# Altium schematic sheet 0003_INDEX -2.SchDoc
size 848 x 558 mm
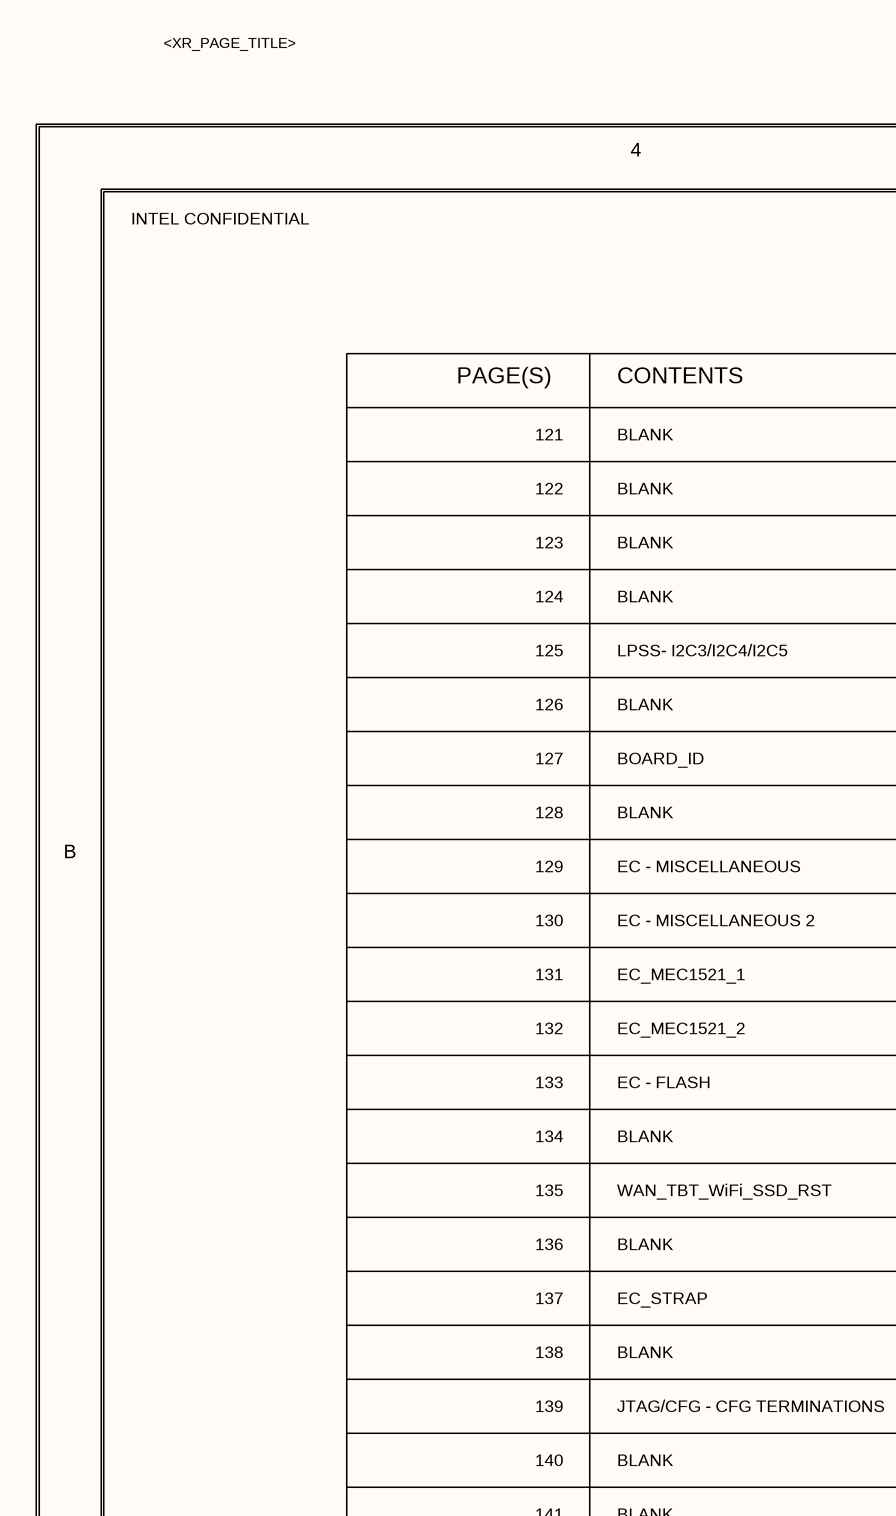
[diagram p0: 0003_INDEX -2.SchDoc, top left]
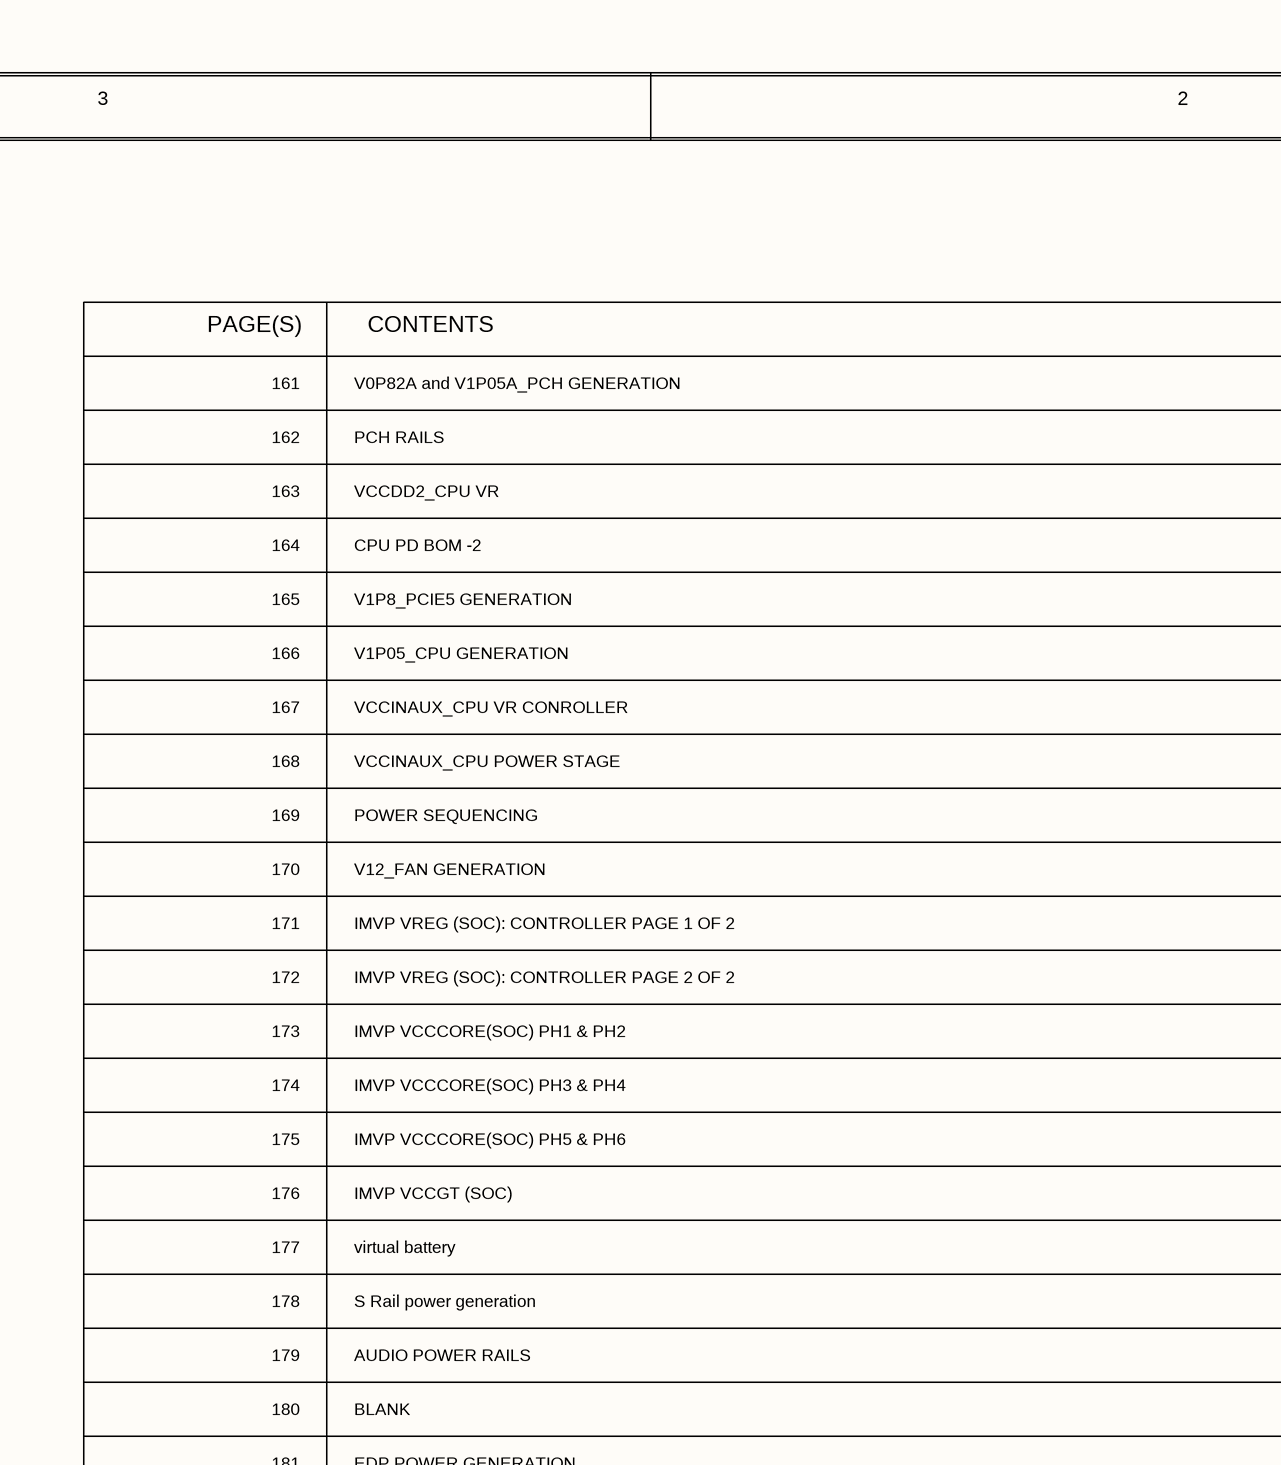
[diagram p1: 0003_INDEX -2.SchDoc, top middle]
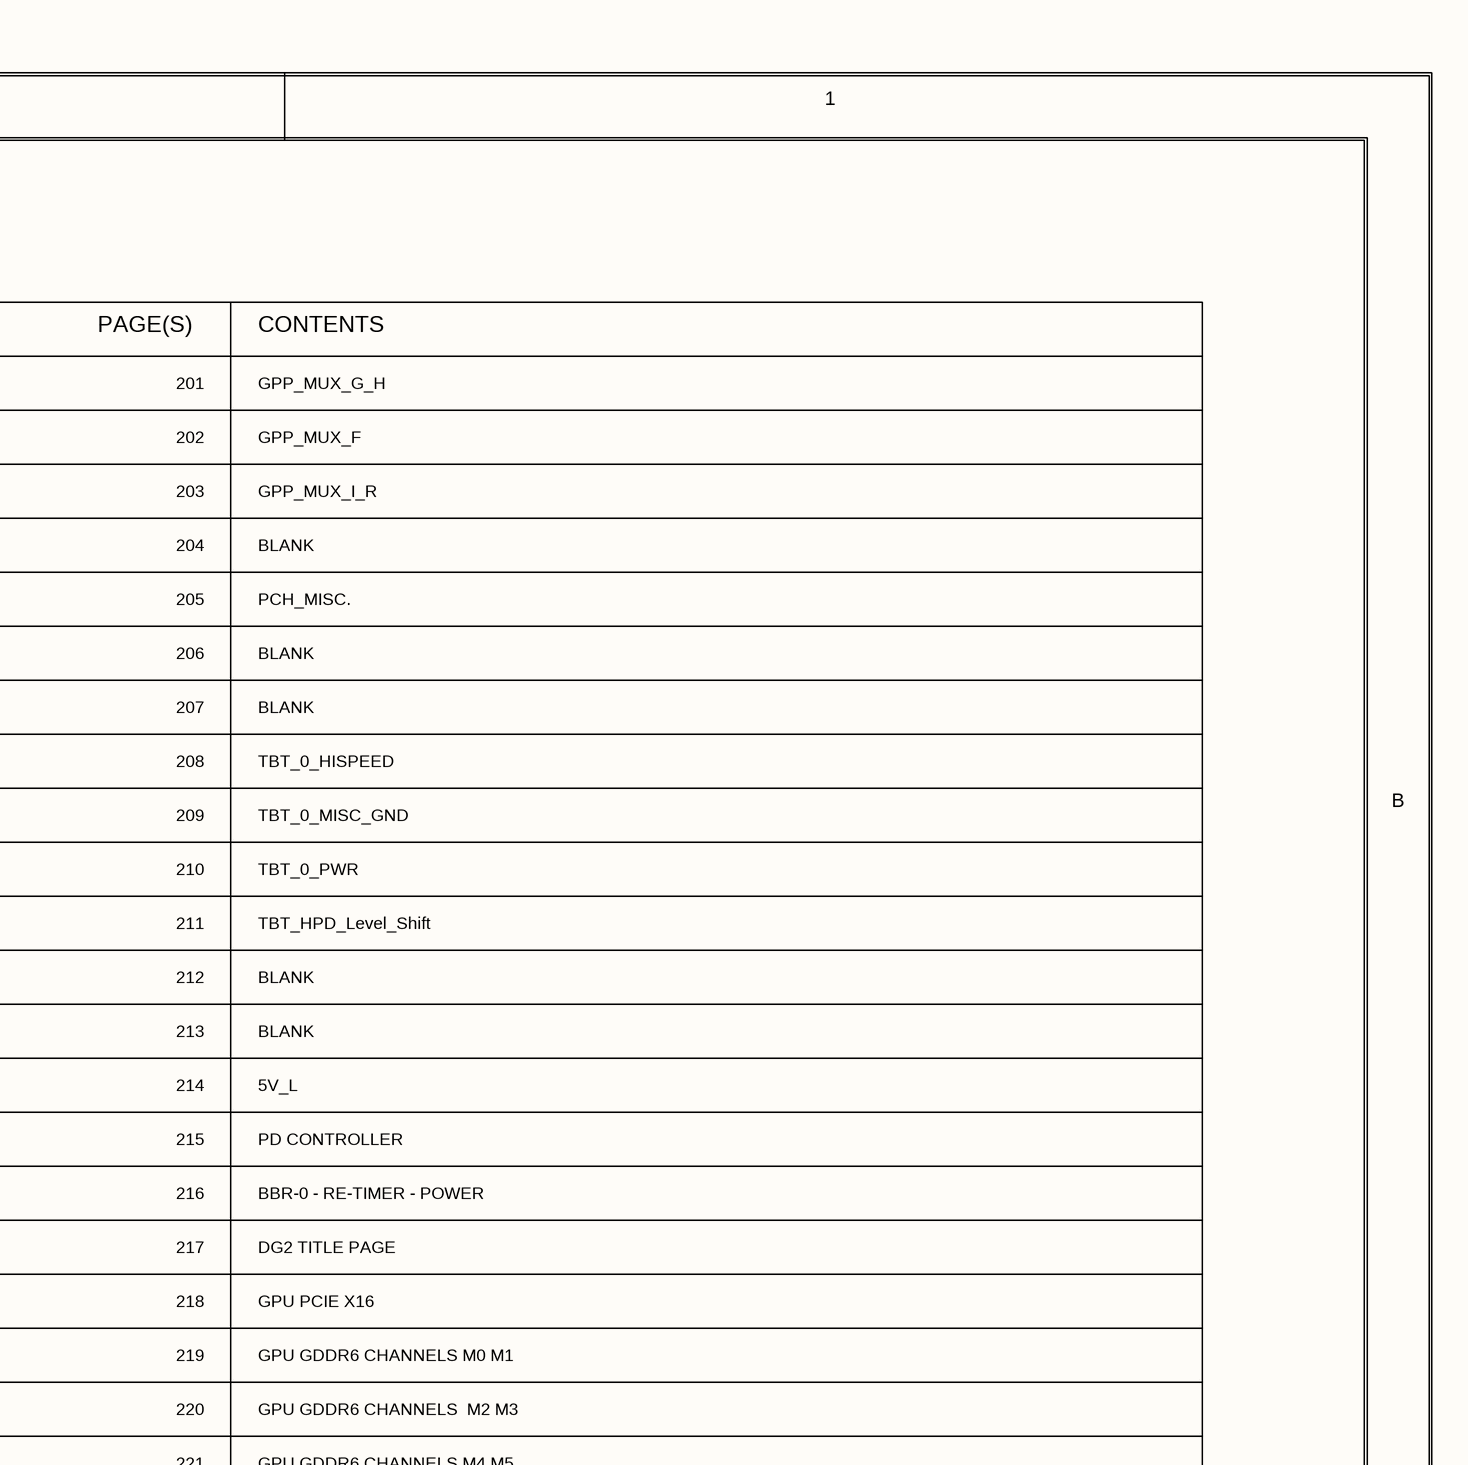
[diagram p2: 0003_INDEX -2.SchDoc, top right]
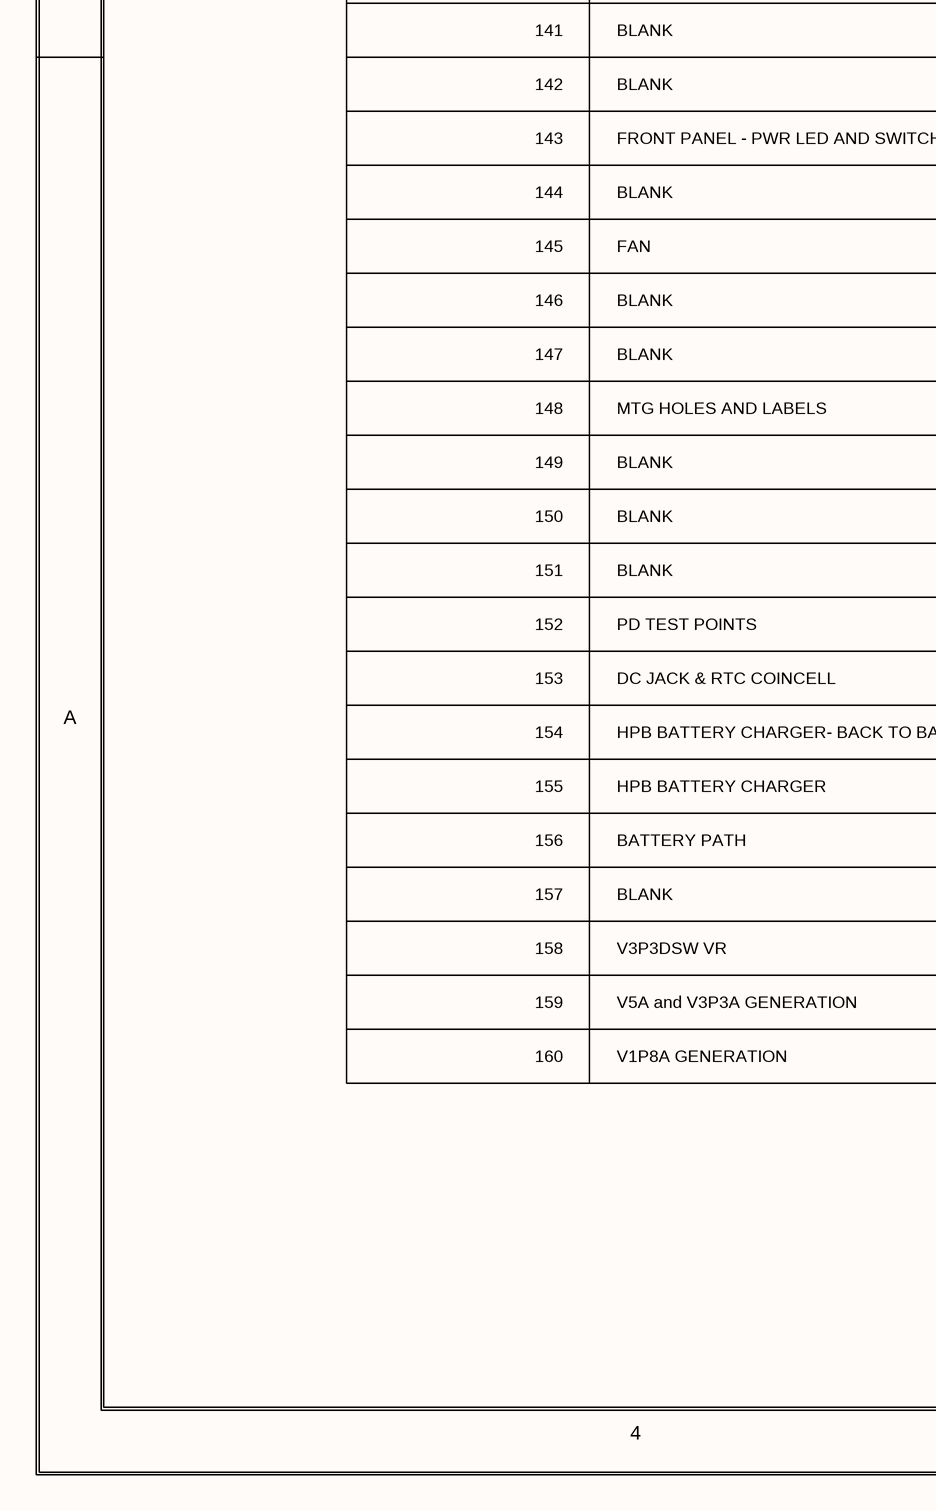
[diagram p3: 0003_INDEX -2.SchDoc, bottom left]
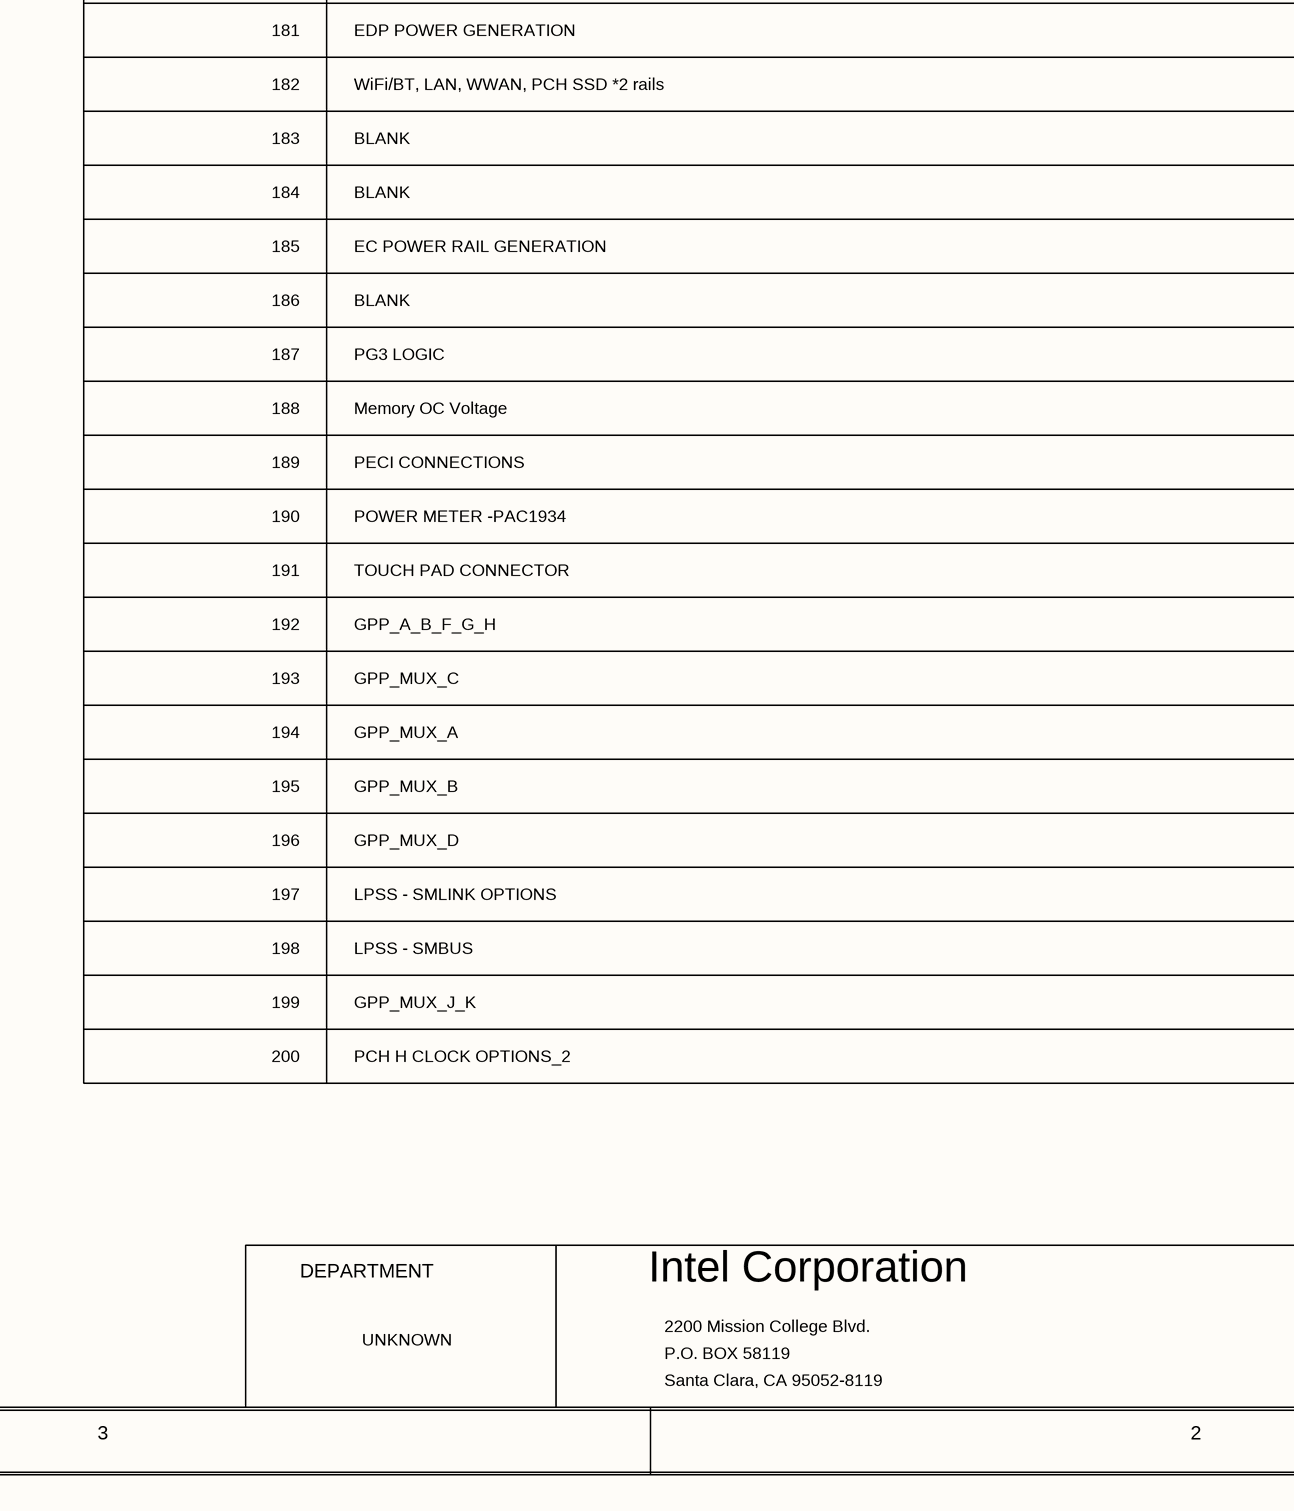
[diagram p4: 0003_INDEX -2.SchDoc, bottom middle]
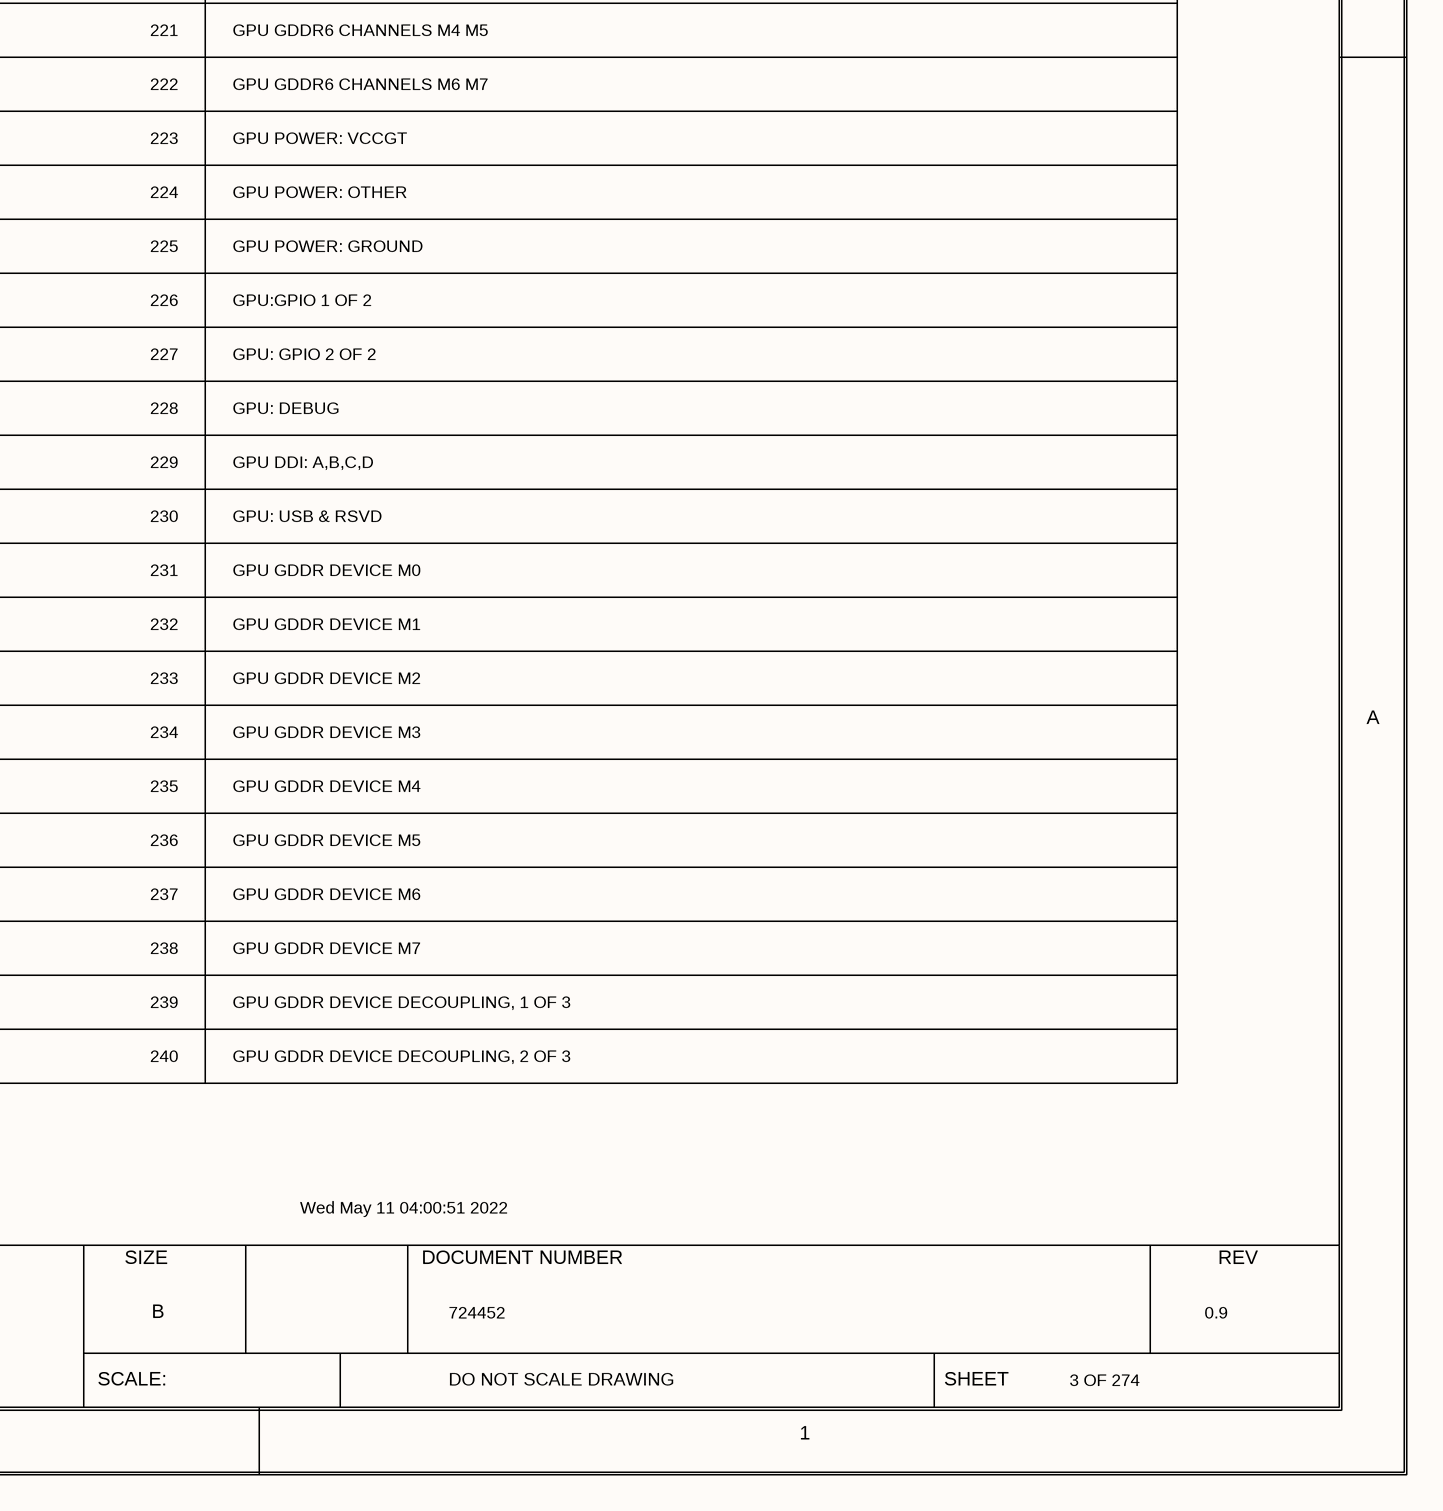
[diagram p5: 0003_INDEX -2.SchDoc, bottom right]

## Notes on the sheet
- <XR_PAGE_TITLE>
- 4
- 3
- 2
- 1
- INTEL CONFIDENTIAL
- PAGE(S)
- CONTENTS
- 121
- BLANK
- 161
- V0P82A and V1P05A_PCH GENERATION
- 201
- GPP_MUX_G_H
- 122
- 162
- PCH RAILS
- 202
- GPP_MUX_F
- 123
- 163
- VCCDD2_CPU VR
- 203
- GPP_MUX_I_R
- 124
- 125
- LPSS- I2C3/I2C4/I2C5
- 164
- 165
- V1P8_PCIE5 GENERATION
- CPU PD BOM -2
- 204
- 205
- PCH_MISC.
- 126
- 166
- V1P05_CPU GENERATION
- 206
- 127
- BOARD_ID
- 167
- VCCINAUX_CPU VR CONROLLER
- 207
- B
- 128
- 168
- VCCINAUX_CPU POWER STAGE
- 208
- TBT_0_HISPEED
- 129
- 130
- EC - MISCELLANEOUS 2
- EC - MISCELLANEOUS
- 170
- 169
- V12_FAN GENERATION
- POWER SEQUENCING
- 210
- 209
- TBT_0_PWR
- TBT_0_MISC_GND
- 131
- EC_MEC1521_1
- 171
- IMVP VREG (SOC): CONTROLLER PAGE 1 OF 2
- 211
- TBT_HPD_Level_Shift
- 132
- EC_MEC1521_2
- 172
- IMVP VREG (SOC): CONTROLLER PAGE 2 OF 2
- 212
- 133
- EC - FLASH
- 173
- IMVP VCCCORE(SOC) PH1 & PH2
- 213
- 135
- 134
- WAN_TBT_WiFi_SSD_RST
- 174
- 175
- IMVP VCCCORE(SOC) PH5 & PH6
- IMVP VCCCORE(SOC) PH3 & PH4
- 214
- 215
- PD CONTROLLER
- 5V_L
- 136
- 176
- IMVP VCCGT (SOC)
- 216
- BBR-0 - RE-TIMER - POWER
- 137
- EC_STRAP
- 177
- virtual battery
- 217
- DG2 TITLE PAGE
- 138
- 178
- S Rail power generation
- 218
- GPU PCIE X16
- 139
- 140
- JTAG/CFG - CFG TERMINATIONS
- 180
- 179
- AUDIO POWER RAILS
- 220
- 219
- GPU GDDR6 CHANNELS M0 M1
- GPU GDDR6 CHANNELS  M2 M3
- 141
- 181
- EDP POWER GENERATION
- 221
- GPU GDDR6 CHANNELS M4 M5
- 142
- 182
- WiFi/BT, LAN, WWAN, PCH SSD *2 rails
- 222
- GPU GDDR6 CHANNELS M6 M7
- 143
- FRONT PANEL - PWR LED AND SWITCH
- 183
- 223
- GPU POWER: VCCGT
- 144
- 145
- FAN
- 184
- 185
- EC POWER RAIL GENERATION
- 225
- 224
- GPU POWER: OTHER
- GPU POWER: GROUND
- 146
- 186
- 226
- GPU:GPIO 1 OF 2
- 147
- 187
- PG3 LOGIC
- 227
- GPU: GPIO 2 OF 2
- 148
- MTG HOLES AND LABELS
- 188
- Memory OC Voltage
- 228
- GPU: DEBUG
- 149
- 150
- 190
- 189
- PECI CONNECTIONS
- POWER METER -PAC1934
- 230
- 229
- GPU: USB & RSVD
- GPU DDI: A,B,C,D
- 151
- 191
- TOUCH PAD CONNECTOR
- 231
- GPU GDDR DEVICE M0
- 152
- PD TEST POINTS
- 192
- GPP_A_B_F_G_H
- 232
- GPU GDDR DEVICE M1
- A
- 153
- DC JACK & RTC COINCELL
- 193
- GPP_MUX_C
- 233
- GPU GDDR DEVICE M2
- 155
- 154
- HPB BATTERY CHARGER- BACK TO BACK
- HPB BATTERY CHARGER
- 194
- 195
- GPP_MUX_A
- GPP_MUX_B
- 235
- 234
- GPU GDDR DEVICE M4
- GPU GDDR DEVICE M3
- 156
- BATTERY PATH
- 196
- GPP_MUX_D
- 236
- GPU GDDR DEVICE M5
- 157
- 197
- LPSS - SMLINK OPTIONS
- 237
- GPU GDDR DEVICE M6
- 158
- V3P3DSW VR
- 198
- LPSS - SMBUS
- 238
- GPU GDDR DEVICE M7
- 159
- 160
- V1P8A GENERATION
- V5A and V3P3A GENERATION
- 200
- 199
- GPP_MUX_J_K
- PCH H CLOCK OPTIONS_2
- 240
- 239
- GPU GDDR DEVICE DECOUPLING, 1 OF 3
- GPU GDDR DEVICE DECOUPLING, 2 OF 3
- Wed May 11 04:00:51 2022
- SIZE
- DOCUMENT NUMBER
- REV
- DEPARTMENT
- Intel Corporation
- 2200 Mission College Blvd.
- 724452
- 0.9
- UNKNOWN
- Santa Clara, CA 95052-8119
- P.O. BOX 58119
- SCALE:
- DO NOT SCALE DRAWING
- SHEET
- 3 OF 274